# EasyEDA Pro project PRJ_Feeder_V01c.epro, board Feeder
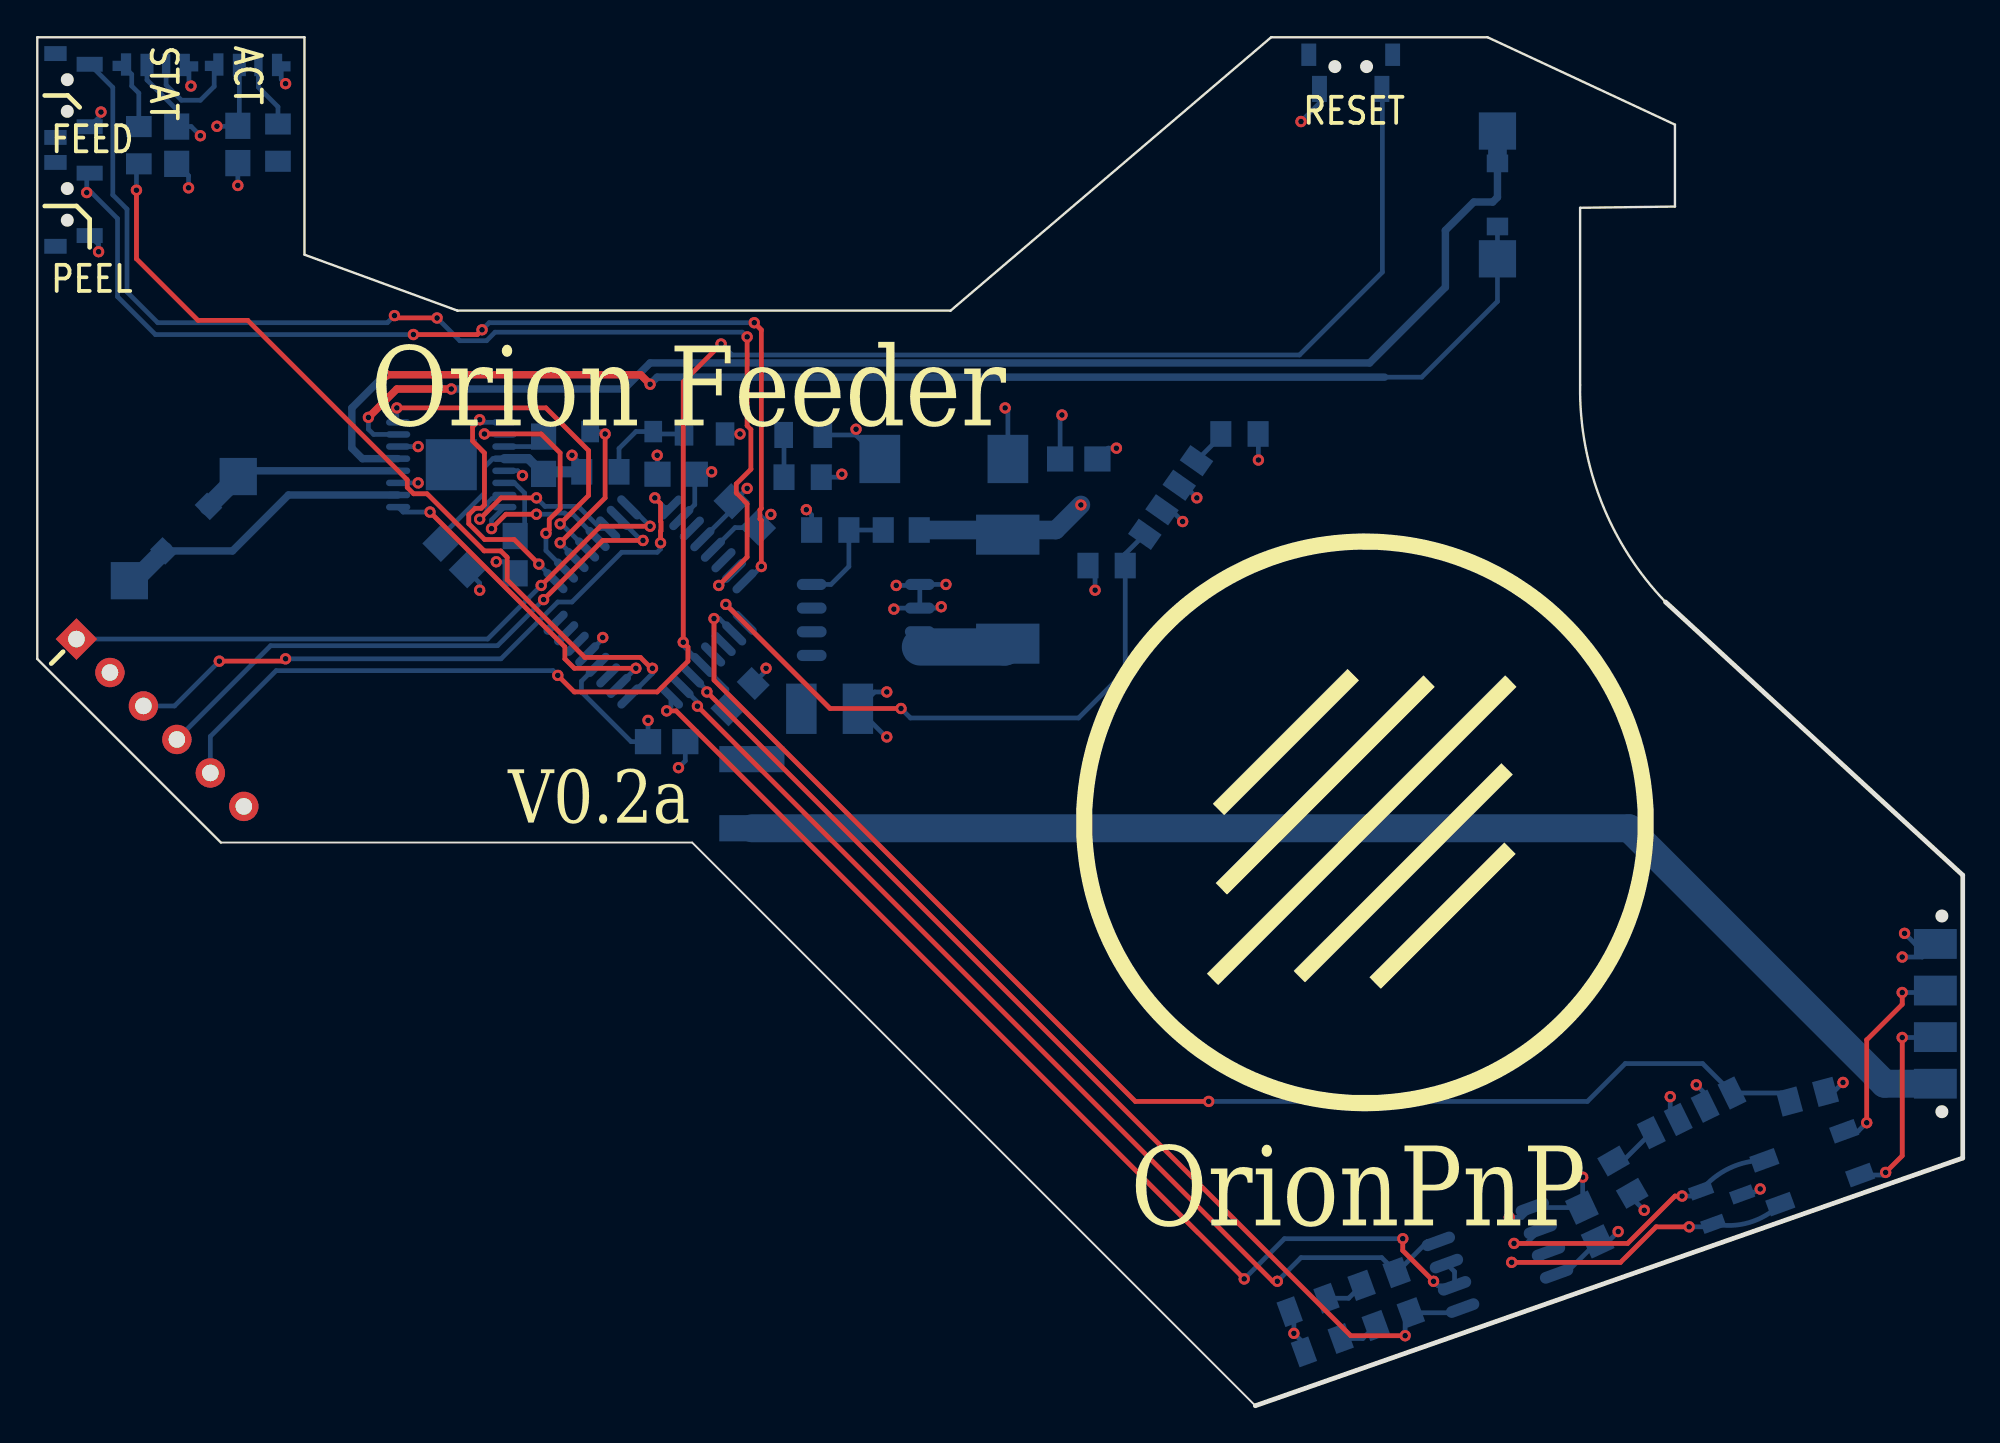
[diagram p17: board, top side]
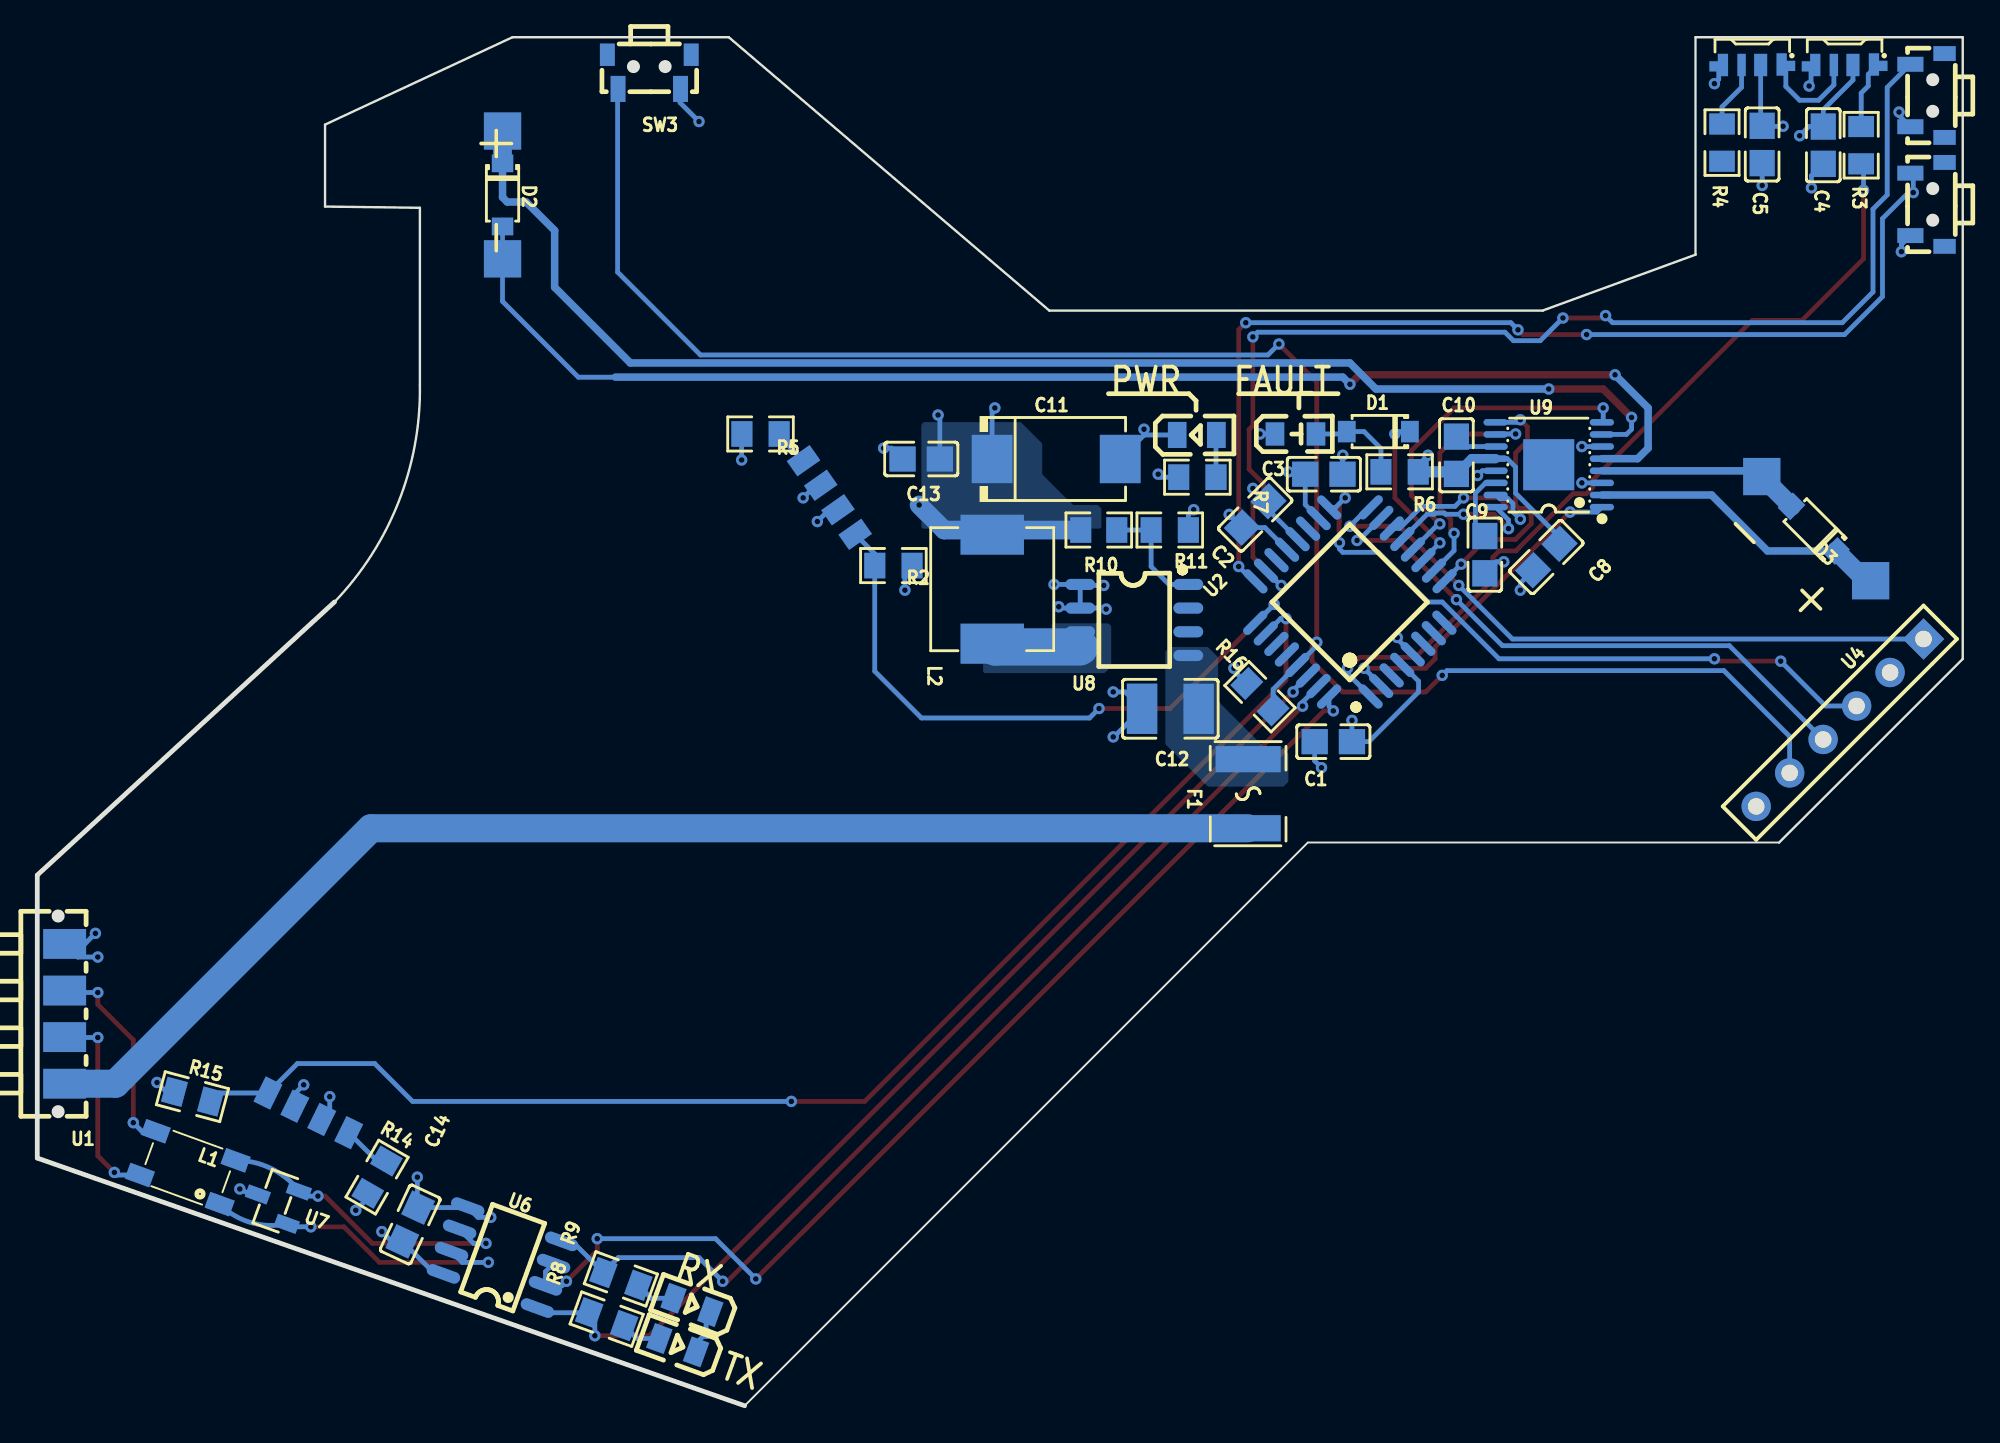
[diagram p18: board, bottom side, seen from below]

Outline 103.31 x 73.43 mm; copper layers: Top Layer, Inner1, Inner2, Bottom Layer. Coordinates in mm from the lower left corner of the outline.
Outline path: 0,73.43 0,40.07 9.85,30.22 35.14,30.22 65.36,0 103.31,13.29 103.31,28.47 87.36,43.13 arc(83.93,48.49) 82.78,54.76 82.78,64.28 87.87,64.35 87.87,68.74 77.82,73.43 66.2,73.43 49.01,58.76 22.54,58.76 14.34,61.76 14.34,73.43 0,73.43
Stack: Top Layer 0.035mm Outer layer thickness 1oz / Dielectric1 0.2133mm 7628 RC49% 8.6mil / Inner1 0.035mm Inner layer thickness / Dielectric2 0.2133mm 1.1mm H/HOZ Copper / Inner2 0.035mm Inner layer thickness / Dielectric3 0.2133mm 7628 RC49% 8.6mil / Bottom Layer 0.035mm Outer layer thickness 1oz

## Design rules (mm)
template: Custom Config
spacing copperThickness1oz (default): track to track 0.102, other pairs 0.152 to 0.3
spacing copperThickness2oz: track to track 0.203, other pairs 0.152 to 0.3
track width copperThickness1oz (default): min 0.127, default 0.254, max 2.54
track width copperThickness2oz: min 0.203, default 0.254, max 2.54
differential pair differentialPair (default): width min 0.127, default 0.254, max 2.54; gap min 0.152, default 0.152
via viaSize (default): diameter min 0.5, default 0.61, max 10; hole min 0.3, default 0.305, max 6.3
pour e162 uses copperRegion

## Placement (name value [footprint] x y rotation side)
C1  100nF  [C0805]  33.77 35.63 180 bottom
C2  100nF  [C0805]  37.96 47.83 135 bottom
C3  100nF  [C0805]  34.28 49.98 0 bottom
C4  100nF  [C0805]  7.48 67.64 270 bottom
C5  100nF  [C0805]  10.76 67.68 270 bottom
C8  10uF  [C0805]  22.34 45.54 135 bottom
C9  100nF  [C0805]  25.64 45.67 270 bottom
C10  2.2uF  [C0805]  27.17 51 90 bottom
C11  220uF  [CAP-SMD_L7.3-W4.3-FD]  48.64 50.8 180 bottom
C12  100uF  [C1210]  42.51 37.4 180 bottom
C13  100nF  [C0805]  55.88 50.8 180 bottom
C14  100nF  [C0805]  83.3 9.73 295 bottom
D1  1N4148W  [SOD-123_L2.8-W1.8-LS3.7-RD]  31.36 52.27 0 bottom
D2  1N4148W  [SOD-123_L2.8-W1.8-LS3.7-RD]  78.35 64.97 270 bottom
D3  1N4148W  [SOD-123_L2.8-W1.8-LS3.7-RD]  7.99 47.06 45 bottom
F1  JK-mSMD075-33  [F1812]  38.34 32.84 90 bottom
L1  ACT45B-510-2P-TL003  [IND-SMD_4P-L4.5-W3.2-TL]  95.24 12.77 20 bottom
L2  33uH  [IND-SMD_L7.1-W6.6_SRP6030VA]  52.07 43.81 90 bottom
LED1  SK6812SIDE-A-RVS  [LED-SMD_4P-L4.0-W1.6-L]  6.34 71.96 0 bottom
LED2  SK6812SIDE-A-RVS  [LED-SMD_4P-L4.0-W1.6-L]  11.29 71.96 0 bottom
LED4  SZYY0805Y  [LED0805-RD_YELLOW]  35.8 52.14 180 bottom
LED5  NCD0805G1  [LED0805-R-RD]  41.1 52.09 180 bottom
LED6  NCD0805G1  [LED0805-R-RD]  68.95 3.25 20 bottom
LED7  NCD0805R1  [LED0805-R-RD]  68.19 5.41 20 bottom
NOREF  -  [Pad_e133]  4.94 44.27 90 top
NOREF#2  -  [Pad_e149]  89.49 16.07 26.2 top
NOREF#3  -  [Pad_e131]  78.35 61.54 0 top
NOREF#4  -  [Pad_e142]  62.2 50.71 234.9 top
NOREF#5  -  [Pad_e148]  88.05 15.36 26.2 top
NOREF#6  -  [Pad_e147]  86.6 14.65 26.2 top
NOREF#7  -  [Pad_e143]  61.27 49.39 234.9 top
NOREF#8  -  [Pad_e150]  90.93 16.78 26.2 top
NOREF#9  -  [Pad_e134]  10.78 49.86 90 top
NOREF#10  -  [Pad_e144]  59.42 46.76 234.9 top
NOREF#11  -  [Pad_e130]  78.35 68.4 0 top
NOREF#12  -  [Pad_e141]  60.35 48.07 234.9 top
R2  10kΩ  [R0805]  57.37 45.08 0 bottom
R3  470Ω  [R0805]  5.45 67.64 90 bottom
R4  470Ω  [R0805]  12.92 67.78 270 bottom
R5  220Ω  [R0805]  64.5 52.14 0 bottom
R6  1kΩ  [R0805]  30.21 50.11 180 bottom
R7  1kΩ  [R0805]  41.07 49.82 0 bottom
R8  1kΩ  [R0805]  72.76 4.65 200 bottom
R9  1kΩ  [R0805]  72 6.8 200 bottom
R10  100kΩ  [R0805_NEW]  46.36 46.99 0 bottom
R11  33kΩ  [R0805]  42.55 46.99 0 bottom
R14  220Ω  [R0805]  85.08 12.27 300 bottom
R15  10kΩ  [R0805]  94.98 16.58 195 bottom
R16  10kΩ  [R0805]  37.71 38.05 45 bottom
SW1  TS24CA 250gf 013  [SW-SMD_L4.7-W3.5-P3.35-EH]  1.89 70.3 270 bottom
SW2  TS24CA 250gf 013  [SW-SMD_L4.7-W3.5-P3.35-EH]  1.89 64.46 270 bottom
SW3  TS24CA 250gf 013  [SW-SMD_L4.7-W3.5-P3.35-EH]  70.47 71.57 180 bottom
U1  YZ165615055F-04025-01  [CONN-SMD_4P-L11.0-W5.5-P2.50_YZ165615055F-04025-01]  101.84 21.03 90 bottom
U2  ATMEGA328PB-AU  [TQFP-32_L7.0-W7.0-P0.80-LS9.0-BL]  32.88 43.13 135 bottom
U4  -  [HDR-M-2.54_1X6]  6.59 36.65 315 bottom
U6  MAX1487EDTR(XBLW)  [SOP-8_L4.9-W3.9-P1.27-LS6.0-BL]  78.35 7.95 110 bottom
U7  PESD2CAN-ES  [SOT-23-3_L2.9-W1.3-P1.90-LS2.4-BR]  90.54 11 200 bottom
U8  -  [SOP-8_L4.9-W3.9-P1.27-LS6.0-TR]  44.45 42.16 180 bottom
U9  DRV8833PWPR  [TSSOP-16_L5.0-W4.4-P0.65-LS6.4-BL-EP]  22.21 50.49 90 bottom

## Footprints (pads in the part's own frame, mm; a bottom-side part is the same pattern mirrored in y, then rotated)
C0805
  rect 1.41x1.35 smd: 1(-1,0) 2(1,0)
C1210
  rect 1.635x2.7 smd: 1(-1.518,0) 2(1.518,0)
CAP-SMD_L7.3-W4.3-FD
  rect 2.185x2.592 smd: 1(-3.437,0) 2(3.437,0)
CONN-SMD_4P-L11.0-W5.5-P2.50_YZ165615055F-04025-01
  rect 1.6x2.3 smd: 1(-3.75,0) 2(-1.25,0) 3(1.25,0) 4(3.75,0)
F1812
  rect 1.407x3.499 smd: 1(-1.853,0) 2(1.853,0)
HDR-M-2.54_1X6
  rect 1.575x1.575 hole 0.889: 1(-6.35,0)
  round 1.575 hole 0.889: 2(-3.81,0) 3(-1.27,0) 4(1.27,0) 5(3.81,0) 6(6.35,0)
IND-SMD_4P-L4.5-W3.2-TL
  rect 1.4x0.9 smd: 1(-2.28,1.25) 2(-2.28,-1.25) 3(2.28,-1.25) 4(2.28,1.25)
IND-SMD_L7.1-W6.6_SRP6030VA
  rect 2.15x3.4 smd: 1(-2.925,0) 2(2.925,0)
LED0805-R-RD
  rect 1x1.399 smd: 1(1.05,0) 2(-1.05,0)
LED0805-RD_YELLOW
  rect 1x1.25 smd: 1(-1.1,0) 2(1.1,0)
LED-SMD_4P-L4.0-W1.6-L
  custom 1x1.2 smd: 1(-1.8,-0.013) 4(1.8,0.013)
  custom 0.7x1.2 smd: 2(-0.45,0.013)
  custom 0.45x1.2 smd: 3(0.575,0.013)
Pad_e130
  rect 2x2 smd far side: (0,0)
Pad_e131
  rect 2x2 smd far side: (0,0)
Pad_e133
  rect 2x2 smd far side: (0,0)
Pad_e134
  rect 2x2 smd far side: (0,0)
Pad_e141
  rect 1x1.5 smd far side: (0,0)
Pad_e142
  rect 1x1.5 smd far side: (0,0)
Pad_e143
  rect 1x1.5 smd far side: (0,0)
Pad_e144
  rect 1x1.5 smd far side: (0,0)
Pad_e147
  rect 1x1.5 smd far side: (0,0)
Pad_e148
  rect 1x1.5 smd far side: (0,0)
Pad_e149
  rect 1x1.5 smd far side: (0,0)
Pad_e150
  rect 1x1.5 smd far side: (0,0)
R0805
  rect 1.133x1.377 smd: 1(-1,0) 2(1,0)
R0805_NEW
  rect 1.133x1.377 smd: 1(-0.966,0) 2(0.966,0)
SOD-123_L2.8-W1.8-LS3.7-RD
  rect 0.95x1.15 smd: 1(-1.692,0) 2(1.692,0)
SOP-8_L4.9-W3.9-P1.27-LS6.0-BL
  oval 0.63x1.865 smd: 1(-1.905,-2.683) 2(-0.635,-2.683) 3(0.635,-2.683) 4(1.905,-2.683) 5(1.905,2.683) 6(0.635,2.683) 7(-0.635,2.683) 8(-1.905,2.683)
SOP-8_L4.9-W3.9-P1.27-LS6.0-TR
  oval 1.6x0.6 smd: 1(2.9,1.905) 2(2.9,0.635) 3(2.9,-0.635) 4(2.9,-1.905) 5(-2.9,-1.905) 6(-2.9,-0.635) 7(-2.9,0.635) 8(-2.9,1.905)
SOT-23-3_L2.9-W1.3-P1.90-LS2.4-BR
  rect 1.25x0.7 smd: 1(1,-0.95) 2(1,0.95) 3(-1,0)
SW-SMD_L4.7-W3.5-P3.35-EH
  rect 0.8x1.4 smd: 1(-1.675,-0.917) 2(1.675,-0.917)
  rect 0.8x1.2 smd: 3(-2.25,0.917) 4(2.25,0.917)
TQFP-32_L7.0-W7.0-P0.80-LS9.0-BL
  oval 0.45x1.65 smd: 1(-2.8,-4.369) 2(-2,-4.369) 3(-1.2,-4.369) 4(-0.4,-4.369) 5(0.4,-4.369) 6(1.2,-4.369) 7(2,-4.369) 8(2.8,-4.369) 17(2.8,4.369) 18(2,4.369) 19(1.2,4.369) 20(0.4,4.369) 21(-0.4,4.369) 22(-1.2,4.369) 23(-2,4.369) 24(-2.8,4.369)
  oval 1.65x0.45 smd: 9(4.381,-2.8) 10(4.381,-2) 11(4.381,-1.2) 12(4.381,-0.4) 13(4.381,0.4) 14(4.381,1.2) 15(4.381,2) 16(4.381,2.8) 25(-4.381,2.8) 26(-4.381,2) 27(-4.381,1.2) 28(-4.381,0.4) 29(-4.381,-0.4) 30(-4.381,-1.2) 31(-4.381,-2) 32(-4.381,-2.8)
TSSOP-16_L5.0-W4.4-P0.65-LS6.4-BL-EP
  oval 0.35x1.3 smd: 1(-2.275,-2.85) 2(-1.625,-2.85) 3(-0.975,-2.85) 4(-0.325,-2.85) 5(0.325,-2.85) 6(0.975,-2.85) 7(1.625,-2.85) 8(2.275,-2.85) 9(2.275,2.85) 10(1.625,2.85) 11(0.975,2.85) 12(0.325,2.85) 13(-0.325,2.85) 14(-0.975,2.85) 15(-1.625,2.85) 16(-2.275,2.85)
  rect 2.74x2.74 smd: 17(0,0)

## Nets
+5V: C1.2 C2.2 C3.2 C4.1 C5.1 C8.2 C10.1 C11.1 C13.2 C14.2 L2.2 LED1.2 LED2.2 NOREF#5. NOREF#7. R5.2 R6.2 R7.2 R10.2 R14.2 R16.2 U2.4 U2.18 U2.20 U6.8 U9.12
GND: C1.1 C2.1 C3.1 C4.2 C5.2 C8.1 C9.2 C11.2 C12.1 C13.1 C14.1 LED1.4 LED2.4 LED4.1 LED5.2 LED6.2 LED7.2 NOREF#2. NOREF#12. R2.1 R11.1 R15.1 SW1.2 SW2.2 SW3.2 U1.4 U2.5 U2.21 U4.6 U6.5 U7.3 U8.7 U8.8 U9.3 U9.6 U9.13 U9.17
VIN: F1.1 U1.1
VINT: C9.1 U9.14
485+: L1.3 U1.3
485-: L1.4 U1.2
AIN1: U2.13 U9.16
AIN2: U2.14 U9.15
BIN1: U2.9 U9.9
BIN2: U2.10 U9.10
CLK: U2.17 U4.3
DI: R9.1 U2.31 U6.4
DRV_FLT: U2.12 U9.8
E1: NOREF#10. R2.2 U2.25
E2: NOREF#8. R15.2 U2.26
FAULT: D1.1 U2.11
FB: R10.1 R11.2 U8.1
L1: NOREF#4. R5.1
L2: NOREF#6. R14.1
M1+: D3.1 NOREF. U9.2
M1-: D3.2 NOREF#9. U9.4
M2+: D2.1 NOREF#11. U9.7
M2-: D2.2 NOREF#3. U9.5
MISO: U2.16 U4.1
MOSI: U2.15 U4.4
RE: U2.32 U6.2 U6.3
RESET: R16.1 SW3.1 U2.29 U4.5
RGB: R3.1 U2.1
RO: R8.1 U2.30 U6.1
SLEEP: U2.2 U9.1
SW1: SW1.1 U2.23
SW2: SW2.1 U2.24
VCP: C10.2 U9.11
$1N1561: LED1.1 R3.2
$1N1767: LED1.3 LED2.1
$1N1887: LED2.3 R4.1
$1N2907: D1.2 LED4.2 R6.1
$1N3068: LED5.1 R7.1
$3N396: C12.2 F1.2 U8.4
$3N943: L2.1 U8.5 U8.6
$5N403: L1.1 U6.7 U7.1
$5N429: L1.2 U6.6 U7.2
$5N858: LED6.1 R8.2
$5N897: LED7.1 R9.2

Pads without a net: R4 2; SW1 3 4; SW2 3 4; SW3 3 4; U2 3 6 7 8 19 22 27 28; U4 2; U8 2 3

## Via types
v1: diameter 0.61, hole 0.305, Top Layer to Bottom Layer, 112 vias

## Routing (per net, layer and track width the routed paths; a pad name or vN(x,y) marks a point on that pad's centre or on a via; arc(x,y) is an arc through that point)
+5V: length 63.1
  Bottom Layer w0.254: 61.27,49.39 61.54,49.39 v1(62.22,48.71) ; R5.2 65.52,52.13 v1(65.52,50.75) ; v1(87.62,16.58) 87.62,15.79 88.05,15.36 ; v1(39.1,39.57) 39.1,39.44 R16.2 ; R6.2 29.21,50.48 v1(28.69,51) ; v1(86.22,10.49) 85.58,11.13 R14.2 ; v1(8.75,68.15) 8.26,68.64 C4.1 7.48,69.54 5.89,71.14 LED1.2 ; v1(38.09,49.22) 37.4,48.53 37.25,48.53 37.25,48.06 U2.20 ; v1(51.93,53.54) 52.08,53.39 C11.1 ; v1(36.18,50.11) 36.06,49.98 C3.2 35.28,48.35 34.56,47.63 ; U2.4 29.2,38.88 29.2,38.3 31.87,35.63 C1.2 v1(32.77,36.78) ; R7.2 43.01,49.82 v1(43.17,49.98) ; v1(9.64,68.65) 10.74,68.65 C5.1 10.84,68.76 LED2.2 ; U9.12 24.44,50.82 23.99,50.37 23.99,48.97 21.63,46.61 C8.2 ; C13.2 54.88,53.06 v1(54.98,53.16) ; U6.8 81.98,7.07 C14.2 84.3,8.82 v1(84.82,9.34)
  Bottom Layer w0.5: U9.12 26.35,50.82 C10.1
  Bottom Layer w0.6: R6.2 27.28,50.11 C10.1
  Bottom Layer w1: v1(56,48.33) 54.65,46.99 R10.2
GND: length 58.8
  Bottom Layer w0.254: v1(100.19,25.35) 100.76,24.78 U1.4 101.14,24.08 v1(100.06,24.08) ; v1(45.58,38.3) 44.93,38.3 C12.1 45.54,35.89 v1(45.58,35.89) ; v1(46.09,44.02) 47.3,44.02 47.35,44.07 ; v1(61.46,47.44) 60.83,48.07 60.35,48.07 ; U8.7 47.35,44.07 ; U8.7 46.02,42.8 v1(45.96,42.75) ; U8.7 48.43,42.8 v1(48.5,42.87) ; 47.35,44.07 v1(48.76,44.07) ; U2.21 37.44,47.12 38.67,47.12 39.36,47.81 v1(39.36,47.83) ; 68.82,70.22 68.82,69.92 v1(67.81,68.91) ; C3.1 33.28,50.98 v1(33.26,51) ; 8.14,71.94 8.14,70.92 v1(8.24,70.81) ; v1(43.93,52.4) 43.93,52.1 43.92,52.09 ; v1(3.29,61.92) 3.29,62.31 SW2.2 ; R2.1 56.76,44.7 v1(56.76,43.76) ; 43.92,52.09 LED5.2 ; 43.92,52.09 C11.2 ; C1.1 34.77,34.6 v1(34.41,34.24) ; 95.95,16.84 96.39,16.84 v1(96.89,17.35) ; v1(26.03,49.91) 25.78,50.17 U9.13 ; v1(78.98,10.11) 79.67,10.11 80.22,10.65 80.24,10.63 C14.1 82.92,10.67 v1(82.92,12.27) ; v1(30.34,41.22) 30.34,41.15 U2.5 ; v1(89.01,17.22) 89.49,16.74 89.49,16.07 ; C5.2 v1(10.76,65.48) ; v1(24.63,45.29) 25.02,45.29 C9.2 ; LED2.4 13.09,71.17 v1(13.32,70.94) ; v1(8.12,65.35) 8.12,66 C4.2 ; LED4.1 v1(37.71,52.14) ; U9.6 v1(20.44,51.47) ; v1(57.9,51.38) 57.46,51.38 C13.1 ; 67.96,2.89 67.96,3.35 v1(67.43,3.88) 67.43,4.82 LED7.2 ; v1(3.42,69.42) 3.42,69.24 SW1.2 ; U9.3 v1(20.44,49.52) ; v1(23.74,43.76) 23.74,44.14 C8.1 ; v1(41.26,48.08) 41.55,47.8 R11.1 ; U7.3 arc(91.98,11.41) v1(92.44,11.63)
VIN: length 69.2
  Bottom Layer w1.5: U1.1 99.12,17.28 85.41,30.99 F1.1
VINT: length 3.8
  Bottom Layer w0.254: C9.1 26.15,47.17 26.15,48.97 25.6,49.52 U9.14
485+: length 11
  Top Layer w0.254: v1(98.16,15.19) 98.16,19.63 100.06,21.54 v1(100.06,22.17)
  Bottom Layer w0.254: U1.3 101.73,22.17 v1(100.06,22.17) ; L1.3 97.7,14.73 v1(98.16,15.19)
485-: length 10.8
  Top Layer w0.254: v1(100.06,19.76) 100.06,13.41 v1(99.18,12.52)
  Bottom Layer w0.254: 97.81,12.38 99.03,12.38 v1(99.18,12.52) ; U1.2 101.82,19.76 v1(100.06,19.76)
AIN1: length 8.1
  Top Layer w0.254: v1(24.37,47.06) 25.14,47.84 v1(26.78,47.84)
  Bottom Layer w0.254: 25.06,48.22 24.37,47.53 v1(24.37,47.06) ; v1(26.78,47.84) 27.75,47.84 27.81,47.9 28.3,47.9 28.36,47.84 28.74,47.84 30.07,46.51
AIN2: length 10.2
  Top Layer w0.254: v1(23.74,47.57) 24.88,48.71 v1(26.78,48.71)
  Bottom Layer w0.254: U9.15 25.03,48.87 24.84,48.67 24.4,48.67 24.13,48.41 24.13,47.97 v1(23.74,47.57) ; v1(26.78,48.71) 27.24,48.26 29.03,48.26 30.21,47.07 U2.14
BIN1: length 13.9
  Top Layer w0.254: v1(23.74,52.91) 23.36,52.52 23.36,51.76 23.99,51.13 23.99,48.33 23.82,48.16 23.5,48.16 23.15,47.81 23.15,47.33 24,46.48 25.59,46.48 v1(26.91,45.16)
  Bottom Layer w0.254: U9.9 23.88,52.77 v1(23.74,52.91) ; v1(26.91,45.16) 27.8,44.27 U2.9
BIN2: length 12.6
  Top Layer w0.254: v1(23.99,52.14) 27.04,52.14 28.06,51.13 28.06,48.14 27.47,47.56 27.47,46.99 v1(27.29,46.81)
  Bottom Layer w0.254: U9.10 25.04,52.14 v1(23.99,52.14) ; v1(27.29,46.81) 27.29,45.89 U2.10
CLK: length 35.2
  Top Layer w0.254: v1(9.77,39.95) 13.2,39.95 v1(13.32,40.08) ; v1(33.44,46.3) 33.44,46.92 33.47,46.95 33.47,47.43 33.44,47.46 33.44,48.41 v1(33.13,48.71)
  Bottom Layer w0.254: 33.99,48.2 33.65,48.2 v1(33.13,48.71) ; v1(33.44,46.3) 33.44,45.97 33.26,45.79 31.36,45.79 28.69,43.13 27.93,43.13 24.88,40.08 v1(13.32,40.08) ; v1(9.77,39.95) 7.36,37.55 5.69,37.55
DI: length 55.5
  Top Layer w0.254: v1(35.42,37.54) 66.28,6.68 v1(66.54,6.68)
  Bottom Layer w0.254: v1(35.42,37.54) 35.42,37.76 U2.31 ; v1(66.54,6.68) 67.81,7.95 72.14,7.95 R9.1 74.61,8.82 U6.4
DRV_FLT: length 18.6
  Top Layer w0.254: v1(28.06,47.32) 29.58,48.84 29.58,51.25 27.29,53.54 v1(19.29,53.54)
  Bottom Layer w0.254: U9.8 19.29,52.84 v1(19.29,53.54) ; v1(28.06,47.32) 28.12,47.32 U2.12
E1: length 34.2
  Top Layer w0.254: v1(46.34,37.41) 42.53,37.41 v1(36.94,43)
  Bottom Layer w0.254: U2.25 37.94,42.01 v1(36.94,43) ; v1(46.34,37.41) 46.85,36.9 55.87,36.9 58.37,39.41 R2.2 58.37,45.71 59.42,46.76
E2: length 73.5
  Top Layer w0.254: v1(62.85,16.33) 58.92,16.33 36.31,38.94 v1(36.31,42.24)
  Bottom Layer w0.254: R15.2 93.56,16.78 90.93,16.78 89.35,18.36 85.21,18.36 83.17,16.33 v1(62.85,16.33) ; v1(36.31,42.24) 36.6,42.24 U2.26
FAULT: length 9
  Top Layer w0.254: v1(30.47,52.14) 30.47,48.71 v1(28.06,46.3)
  Bottom Layer w0.254: v1(28.06,46.3) 28.93,45.42 U2.11 ; D1.1 30.34,52.27 v1(30.47,52.14)
FB: length 6.2
  Bottom Layer w0.254: R10.1 R11.2 43.55,45.03 42.59,44.07 41.55,44.07
L1: length 2
  Bottom Layer w0.254: 62.2,50.71 63.5,52.01 R5.1
L2: length 2.7
  Bottom Layer w0.254: 86.6,14.65 85.08,13.13 84.58,13.13
M1+: length 16.3
  Bottom Layer w0.4: D3.1 10.48,45.87 13.48,48.87 19.35,48.87
  Bottom Layer w1: 4.94,44.27 5.19,44.27 D3.1
M1-: length 11
  Bottom Layer w0.4: 19.35,50.17 11.09,50.17 10.78,49.86
  Bottom Layer w1: 10.78,49.86 D3.2
M2+: length 73.1
  Top Layer w0.4: v1(17.77,53.03) 19.29,54.56 v1(22.21,54.56)
  Bottom Layer w0.254: 19.35,52.12 18.05,52.12 17.77,52.4 v1(17.77,53.03)
  Bottom Layer w0.4: D2.1 78.35,64.84 78.09,64.59 77.08,64.59 75.55,63.07 75.55,60.02 71.49,55.95 32.88,55.95 31.48,54.56 v1(22.21,54.56)
  Bottom Layer w1: 78.35,68.4 D2.1
M2-: length 73.1
  Top Layer w0.4: v1(32.88,54.81) 32.37,55.32 v1(18.66,55.32)
  Bottom Layer w0.254: D2.2 78.35,59.26 74.28,55.19 72.29,55.19
  Bottom Layer w0.4: v1(18.66,55.32) 16.88,53.54 16.88,51.38 17.44,50.82 19.35,50.82 ; 72.29,55.19 33.26,55.19 v1(32.88,54.81)
MISO: length 34.8
  Top Layer w0.254: v1(32.88,47.19) 30.21,47.19 v1(27.04,44.02)
  Bottom Layer w0.254: 2.1,41.14 24.16,41.14 v1(27.04,44.02) ; U2.16 31.87,48.2 v1(32.88,47.19)
MOSI: length 31.2
  Top Layer w0.254: v1(27.17,43.25) 30.34,46.43 v1(32.5,46.43)
  Bottom Layer w0.254: U4.4 12.52,40.78 24.7,40.78 v1(27.17,43.25) ; U2.15 32.41,46.43 v1(32.5,46.43)
RE: length 59.4
  Top Layer w0.254: v1(73.27,8.96) 73.27,8.33 v1(74.92,6.68) ; v1(33.77,37.28) 34.28,37.28 v1(64.76,6.8)
  Bottom Layer w0.254: v1(73.27,8.96) 66.92,8.96 v1(64.76,6.8) ; v1(74.92,6.68) 75.16,6.43 76.04,6.43 76.04,7.19 U6.3 ; U2.32 34,37.51 v1(33.77,37.28)
RESET: length 99.7
  Top Layer w0.254: v1(27.93,39.19) 28.82,38.3 33.26,38.3 34.91,39.95 34.91,40.71 v1(34.66,40.97) 34.66,54.94 v1(36.69,56.97)
  Bottom Layer w0.254: v1(36.69,56.97) 37.28,56.38 67.73,56.38 72.17,60.83 72.17,70.22 ; U4.5 9.29,35.91 12.81,39.44 27.67,39.44 v1(27.93,39.19) ; v1(34.66,40.97) 34.66,40.78 37,38.44 R16.1
RGB: length 44.9
  Top Layer w0.254: v1(33.01,39.57) 32.94,39.57 32.36,40.15 29.38,40.15 25.21,44.32 25.21,45.53 24.87,45.87 23.98,45.87 20.92,48.93 20.19,48.93 19.85,49.28 19.85,49.68 11.29,58.24 8.62,58.24 5.32,61.54 v1(5.32,65.22)
  Bottom Layer w0.254: 31.77,38.06 33.01,39.29 v1(33.01,39.57) ; R3.1 5.32,66.51 v1(5.32,65.22)
RO: length 57.2
  Top Layer w0.254: v1(73.39,3.76) 70.47,3.76 v1(35.93,38.3)
  Bottom Layer w0.254: v1(35.93,38.3) 35.93,38.38 U2.30 ; 76.48,5.24 76.23,4.99 73.7,4.99 73.39,4.68 v1(73.39,3.76)
SLEEP: length 18
  Top Layer w0.254: v1(21.07,47.95) 28.31,40.71 28.31,40.08 28.82,39.57 v1(32.12,39.57)
  Bottom Layer w0.254: 19.36,48.22 19.63,47.95 v1(21.07,47.95) ; 31.21,38.62 31.21,38.66 v1(32.12,39.57)
SW1: length 63.8
  Top Layer w0.254: v1(36.56,44.02) 38.09,45.54 38.09,48.4 37.5,48.98 37.5,49.46 38.29,50.25 38.29,52.39 38.09,52.59 v1(38.09,57.35) ; v1(19.17,58.49) 19.29,58.37 v1(21.45,58.37)
  Bottom Layer w0.254: v1(21.45,58.37) 22.67,57.15 24.11,57.15 24.56,57.6 37.83,57.6 v1(38.09,57.35) ; SW1.1 4.05,70.74 4.05,64.97 4.81,64.21 4.81,59.76 6.47,58.11 18.78,58.11 v1(19.17,58.49) ; U2.23 36.6,44.02 v1(36.56,44.02)
SW2: length 57.3
  Top Layer w0.254: v1(38.85,45.03) 38.85,47.51 38.77,47.58 38.77,48.07 38.85,48.14 38.85,57.73 v1(38.47,58.11) ; v1(20.18,57.48) 23.61,57.48 v1(23.86,57.73)
  Bottom Layer w0.254: 2.81,66.14 2.66,65.98 v1(2.66,65.1) 2.91,65.1 4.31,63.7 4.31,59.51 6.34,57.48 v1(20.18,57.48) ; v1(23.86,57.73) 24.25,58.11 v1(38.47,58.11) ; U2.24 38.05,44.24 v1(38.85,45.03)
VCP: length 2.6
  Bottom Layer w0.254: U9.11 27.17,51.47 C10.2
$1N1561: length 3.7
  Bottom Layer w0.254: LED1.1 5.07,71.44 5.07,70.81 5.45,70.43 R3.2
$1N1767: length 5.5
  Bottom Layer w0.254: LED2.1 9.49,70.79 8.75,70.05 7.73,70.05 6.91,70.87 LED1.3
$1N1887: length 3.6
  Bottom Layer w0.254: R4.1 12.92,69.7 11.87,70.75 LED2.3
$1N2907: length 5.2
  Bottom Layer w0.254: R6.1 31.21,51.37 32.12,52.27 D1.2 33.18,52.14 LED4.2
$1N3068: length 2.3
  Bottom Layer w0.254: R7.1 40.07,52.07 LED5.1
$3N943: length 4.8
  Bottom Layer w2: L2.1 51.9,40.71 47.39,40.71
$5N403: length 17.8
  Top Layer w0.254: v1(88.63,9.6) 86.86,9.6 84.95,7.69 v1(79.11,7.69)
  Bottom Layer w0.254: U6.7 80.51,7.69 v1(79.11,7.69) ; v1(88.63,9.6) 89.76,9.6 89.92,9.76 arc(91.86,9.83) L1.1
$5N429: length 16.8
  Top Layer w0.254: v1(79.24,8.71) 85.33,8.71 87.87,11.25 v1(88.25,11.25)
  Bottom Layer w0.254: v1(88.25,11.25) 88.98,11.25 U7.2 arc(90.79,12.74) L1.2 ; v1(79.24,8.71) 79.9,8.71 U6.6
$5N858: length 2.2
  Bottom Layer w0.254: 69.94,3.61 71.12,3.61 R8.2
$5N897: length 2.2
  Bottom Layer w0.254: R9.2 70.36,5.77 LED7.1

## Copper pours and planes (outline as drawn; the poured copper is in the pictures)
+5V on Bottom Layer: 47.74,48.33 49.39,49.98 49.39,51.64 50.53,52.78 55.74,52.78 55.87,52.65 55.87,47.06 46.22,47.06 46.22,48.15 46.4,48.33
+5V on Inner1: 0.26,73.17 103.05,73.17 103.05,0.29 0.26,0.29
GND on Inner2: 0.26,73.17 103.05,73.17 103.05,0.29 0.26,0.29
$3N396 on Bottom Layer: 40.5,40.71 42.53,40.71 42.79,40.46 42.79,35.51 40.5,33.22 36.44,33.22 36.18,33.47 36.18,35 36.56,35.38 37.53,35.38 39.95,37.8 39.95,40.16
$3N943 on Bottom Layer: 52.57,41.98 52.57,39.32 46.04,39.32 45.69,39.66 45.69,41.84 45.84,41.98

Small or netless copper shapes (teardrops, artwork), in the pictures only: 1 on Inner1, 4 on Inner2

## Text on the board
Bottom Silkscreen Layer: TX | RX | PWR | FAULT | +  -
Top Silkscreen Layer: RESET | PEEL | FEED | ACT / STAT | V0.2a | Orion Feeder | OrionPnP
